# Altium schematic sheet microcontroleur.SchDoc: Projet M1 2024
size A4; DrawnBy: J.CLEMENT & D.FOURNIER; DocumentNumber: 1; Revision: V1.0 Rev A; SheetNumber: 1; SheetTotal: 7
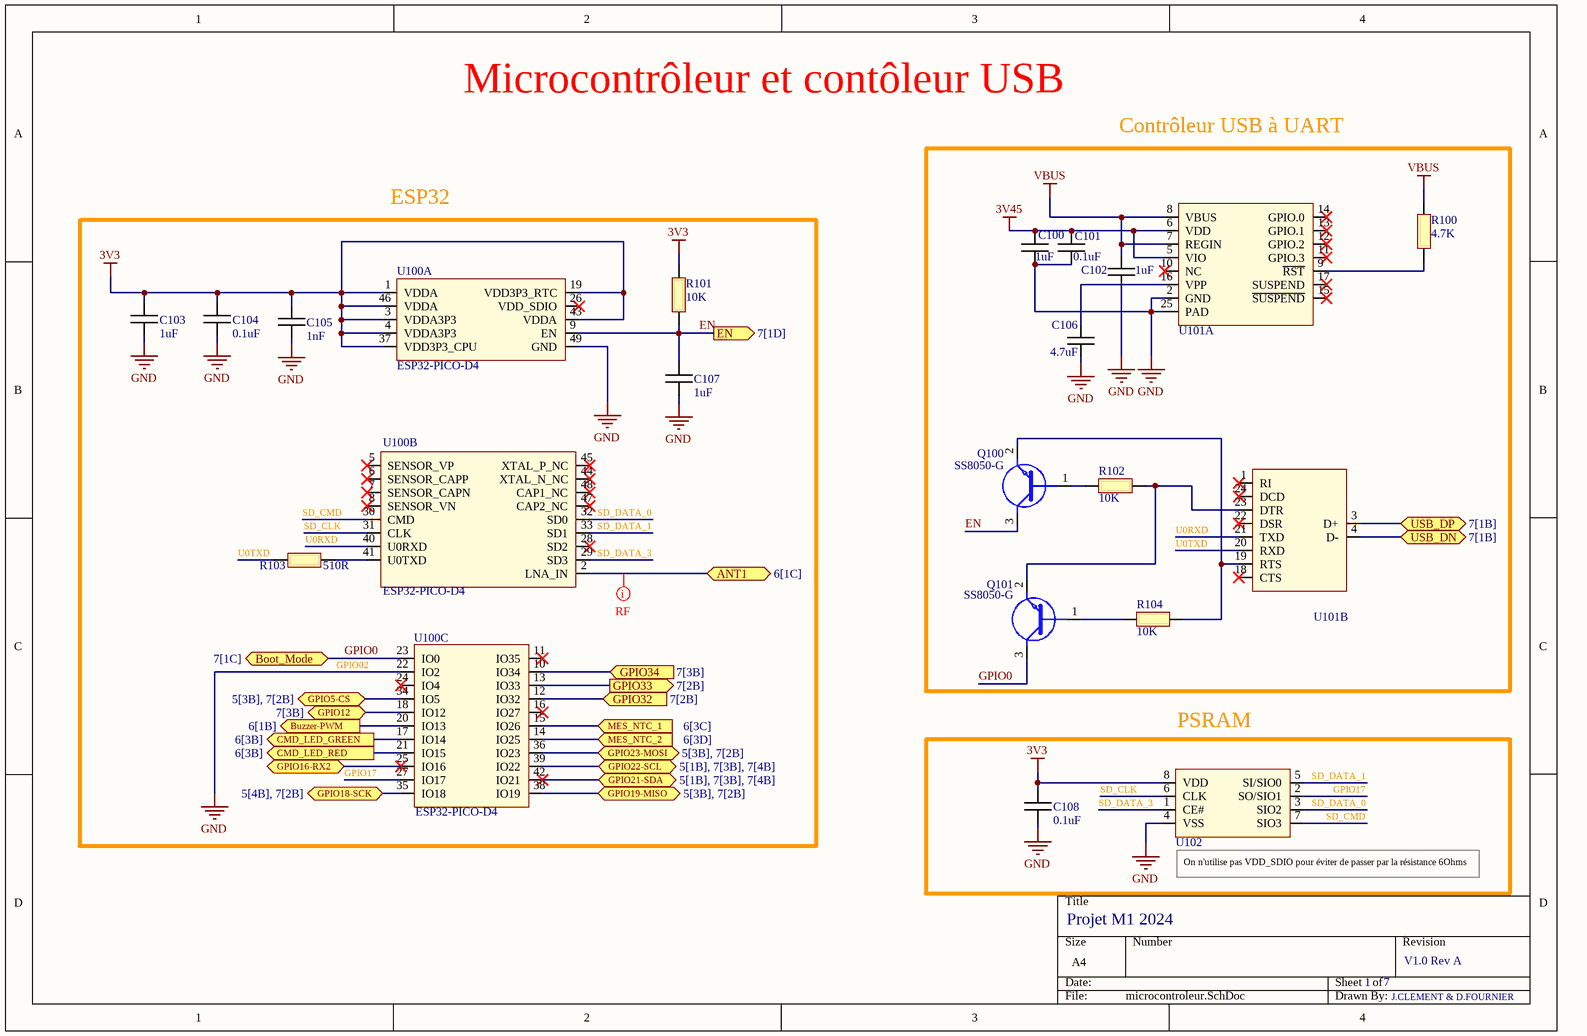
[diagram p0: microcontroleur.SchDoc]

## Parts
C100  1uF  [CAPA_0603]
C101  0.1uF  [CAPA_0603]
C102  1uF  [CAPA_0603]
C103  1uF  [CAPA_0603]
C104  0.1uF  [CAPA_0603]
C105  1nF  [CAPA_0603]
C106  4.7uF  [CAPA_0603]
C107  1uF  [CAPA_0603]
C108  0.1uF  [CAPA_0603]
Q100  SS8050-G  [SS8050-G]
Q101  SS8050-G  [SS8050-G]
R100  4.7K  [RES_0603]
R101  10K  [RES_0603]
R102  10K  [RES_0603]
R103  510R  [RES_0603]
R104  10K  [RES_0603]
U100  ESP32-PICO-D4  [PQFN50P700X700X104_HS-49N]  (parts A,B,C of 3)
U101  CP2104-F03-GM  [PQFN50P400X400X80_HS-25N]  (value not drawn)  (parts A,B of 2)
U102  IS66WVS1M8BLL-104NLI  [SOIC127P600X175-8N]  (value not drawn)

## Blocks framed on the sheet
Contrôleur USB à UART: C100-C102 C106 Q100 Q101 R100 R102 R104 U101
ESP32: C103-C105 C107 R101 R103 U100
PSRAM: C108 U102

## Ports
ANT1 (bidir, see 6[1C]), Boot_Mode (bidir, see 7[1C]), Buzzer-PWM (out, see 6[1B]), CMD_LED_GREEN (out, see 6[3B]), CMD_LED_RED (out, see 6[3B]), EN (out, see 7[1D]), GPIO5-CS (bidir, see 5[3B], 7[2B]), GPIO12 (bidir, see 7[3B]), GPIO16-RX2 (bidir), GPIO18-SCK (bidir, see 5[4B], 7[2B]), GPIO19-MISO (bidir, see 5[3B], 7[2B]), GPIO21-SDA (bidir, see 5[1B], 7[3B], 7[4B]), GPIO22-SCL (bidir, see 5[1B], 7[3B], 7[4B]), GPIO23-MOSI (bidir, see 5[3B], 7[2B]), GPIO32 (in, see 7[2B]), GPIO33 (out, see 7[2B]), GPIO34 (in, see 7[3B]), MES_NTC_1 (in, see 6[3C]), MES_NTC_2 (in, see 6[3D]), USB_DN (bidir, see 7[1B]), USB_DP (bidir, see 7[1B])

## Nets
3V3: C103.1 C104.1 C105.1 C108.1 R101.2 U100.1(VDDA) U100.3(VDDA3P3) U100.4(VDDA3P3) U100.19(VDD3P3_RTC) U100.37(VDD3P3_CPU) U100.43(VDDA) U100.46(VDDA) U102.8(VDD)
3V45: C100.1 C101.1 U101.5(VIO) U101.6(VDD)
GND: C100.2 C101.2 C102.2 C103.2 C104.2 C105.2 C106.2 C107.2 C108.2 U100.22(IO2) U100.49(GND) U101.2(GND) U101.25(PAD) U102.4(VSS)
VBUS: C102.1 R100.2 U101.7(REGIN) U101.8(VBUS)
ANT1: U100.2(LNA_IN) ; port ANT1
Buzzer-PWM: U100.20(IO13) ; port Buzzer-PWM
CMD_LED_GREEN: U100.17(IO14) ; port CMD_LED_GREEN
CMD_LED_RED: U100.21(IO15) ; port CMD_LED_RED
EN: C107.1 Q100.3(C) R101.1 U100.9(EN) ; port EN
GPIO0: Q101.3(C) U100.23(IO0) ; port Boot_Mode
GPIO5-CS: U100.34(IO5) ; port GPIO5-CS
GPIO12: U100.18(IO12) ; port GPIO12
GPIO16-RX2: U100.25(IO16) ; port GPIO16-RX2
GPIO17: U100.27(IO17) U102.2(SO/SIO1)
GPIO18-SCK: U100.35(IO18) ; port GPIO18-SCK
GPIO19-MISO: U100.38(IO19) ; port GPIO19-MISO
GPIO21-SDA: U100.42(IO21) ; port GPIO21-SDA
GPIO22-SCL: U100.39(IO22) ; port GPIO22-SCL
GPIO23-MOSI: U100.36(IO23) ; port GPIO23-MOSI
GPIO32: U100.12(IO32) ; port GPIO32
GPIO33: U100.13(IO33) ; port GPIO33
GPIO34: U100.10(IO34) ; port GPIO34
MES_NTC_1: U100.15(IO26) ; port MES_NTC_1
MES_NTC_2: U100.14(IO25) ; port MES_NTC_2
SD_CLK: U100.31(CLK) U102.6(CLK)
SD_CMD: U100.30(CMD) U102.7(SIO3)
SD_DATA_0: U100.32(SD0) U102.3(SIO2)
SD_DATA_1: U100.33(SD1) U102.5(SI/SIO0)
SD_DATA_3: U100.29(SD3) U102.1(CE#)
U0RXD: U100.40(U0RXD) U101.21(TXD)
U0TXD: R103.1 U101.20(RXD)
USB_DN: U101.4(D-) ; port USB_DN
USB_DP: U101.3(D+) ; port USB_DP
NetC106_1: C106.1 U101.16(VPP)
NetQ100_1: Q100.1(B) R102.1
NetQ100_2: Q100.2(E) R104.2 U101.19(RTS)
NetQ101_1: Q101.1(B) R104.1
NetQ101_2: Q101.2(E) R102.2 U101.23(DTR)
NetR100_1: R100.1 U101.9(~{RST})
NetR103_2: R103.2 U100.41(U0TXD)

Not connected (* = marked no-connect by the designer): U100 5(SENSOR_VP)* 6(SENSOR_CAPP)* 7(SENSOR_CAPN)* 8(SENSOR_VN)* 11(IO35)* 16(IO27)* 24(IO4)* 26(VDD_SDIO)* 28(SD2)* 44(XTAL_N_NC)* 45(XTAL_P_NC)* 47(CAP2_NC)* 48(CAP1_NC)*; U101 1(RI)* 10(NC)* 11(GPIO.3)* 12(GPIO.2)* 13(GPIO.1)* 14(GPIO.0)* 15(~{SUSPEND})* 17(SUSPEND)* 18(CTS)* 22(DSR)* 24(DCD)*

## Layout directives
rule Width Constraint [Pref Impedance = 50.00ohms    Min Impedance = 50.00ohms    Max Impedance = 50.00ohms]: ANT1

## Notes on the sheet
- Microcontrôleur et contôleur USB
- (near U100) GPIO02
- (near U102) On n'utilise pas VDD_SDIO pour éviter de passer par la résistance 6Ohms

## Library data of the parts
C100-C108 = Capacitor
  C103: Parameter 1: *
Q100 Q101 = SS8050-G: Bipolar Transistors - BJT NPN TRANSISTOR 1.5A 40V
R100-R104 = Resistor
U100 = ESP32: Système RF sur puce - SoC SIP module ESP32 with 4MByte Flash, Dual Core MCU, Wi-Fi & Bluetooth Combo, LGA48-pin, 7*7mm; Manufacturer 1: Espressif Systems; Supplier 1: Digi-Key; Supplier Part Number 1: 1904-1029-1-ND; Manufacturer Part Number 1: ESP32-PICO-D4
U101 = USBBridge: USB Bridge, USB to UART USB 2.0 UART Interface 24-QFN (4x4); Manufacturer 1: Silicon Labs; Supplier 1: Arrow Electronics; Supplier Part Number 1: CP2104-F03-GM; Manufacturer Part Number 1: CP2104-F03-GM
U102 = SRAM: SRAM 8Mb, SerialRAM, 2.7V-3.6V, 104MHz, 8 pin SOIC 150 mil, RoHS; Manufacturer 1: ISSI; Supplier 1: Digi-Key; Supplier Part Number 1: 706-IS66WVS1M8BLL-104NLI-ND; Manufactuer Part Number 1: IS66WVS1M8BLL-104NLI